# Altium schematic sheet power.SchDoc
size A; SheetNumber: 6; SheetTotal: 6
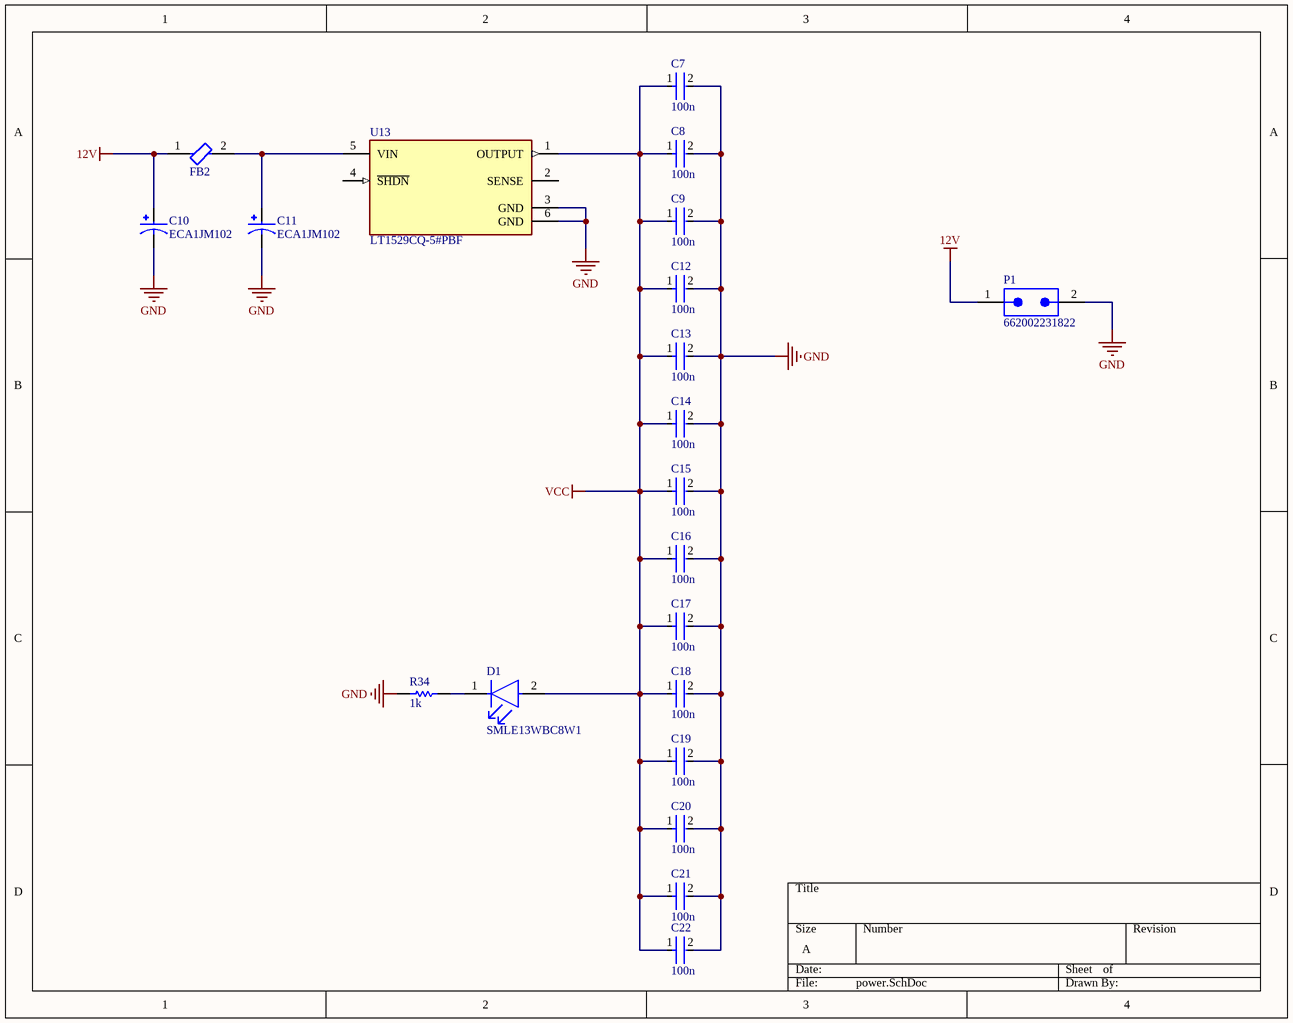
[diagram p0: power.SchDoc]

## Parts
C7  100n  [FP-CL10-IPC_C]
C8  100n  [FP-CL10-IPC_C]
C9  100n  [FP-CL10-IPC_C]
C10  ECA1JM102  [CAPPRD750W80D1600H2500]
C11  ECA1JM102  [CAPPRD750W80D1600H2500]
C12  100n  [FP-CL10-IPC_C]
C13  100n  [FP-CL10-IPC_C]
C14  100n  [FP-CL10-IPC_C]
C15  100n  [FP-CL10-IPC_C]
C16  100n  [FP-CL10-IPC_C]
C17  100n  [FP-CL10-IPC_C]
C18  100n  [FP-CL10-IPC_C]
C19  100n  [FP-CL10-IPC_C]
C20  100n  [FP-CL10-IPC_C]
C21  100n  [FP-CL10-IPC_C]
C22  100n  [FP-CL10-IPC_C]
D1  SMLE13WBC8W1  [FP-SMLE13WBC8W1-MFG]
FB2  BLM18KG121TN1D  [FP-BLM18-0_15-t0_6-d1_2-IPC_A]  (value not drawn)
P1  662002231822  [662002231822]
R34  1k  [RESC2013X60X35ML10T20]
U13  LT1529CQ-5#PBF  [FP-Q-5-05-08-1461-MFG]

## Nets
12V: C10.P FB2.1 P1.1
GND: C7.2 C8.2 C9.2 C10.N C11.N C12.2 C13.2 C14.2 C15.2 C16.2 C17.2 C18.2 C19.2 C20.2 C21.2 C22.2 P1.2 R34.1 U13.3(GND) U13.6(GND)
VCC: C7.1 C8.1 C9.1 C12.1 C13.1 C14.1 C15.1 C16.1 C17.1 C18.1 C19.1 C20.1 C21.1 C22.1 D1.2(A) U13.1(OUTPUT)
NetC11_P: C11.P FB2.2 U13.5(VIN)
NetD1_1: D1.1(C) R34.2

Not connected (* = marked no-connect by the designer): U13 2(SENSE) 4(~{SHDN})

## Library data of the parts
C7-C9 C12-C22 = CMP-13271-003017-1: Cap Ceramic 4.7uF 10V X5R ±10% Pad SMD 0603 +85°C T/R; Capacitance: 4.7uF; Case/Package: 0603; Packaging: Tape and Reel; Width: 0.031inch; Contact Plating: Tin; Thickness: 0.035inch; Package Quantity: 1; Voltage Rating: 10V; Case Code (Metric): 1608; Case Code (Imperial): 0603; Depth: 0.8mm; Height: 0.8mm; Tolerance: 10%; Max Operating Temperature: 85°C; Length: 1.6mm; Dielectric: X5R; Mount: Surface Mount; Radiation Hardening: No; Min Operating Temperature: -55°C
C10 C11 = ECA1JM102: 1000ÂµF 63V Aluminum Electrolytic Capacitors Radial, Can 2000 Hrs @ 85Â°C; MF: Panasonic; Availability: Not in stock; Check_prices: https://www.snapeda.com/parts/ECA1JM102/Panasonic/view-part/5782477/?ref=eda; Package: RADIAL-2 Panasonic; SnapEDA_Link: https://www.snapeda.com/parts/ECA1JM102/Panasonic/view-part/5782477/?ref=snap; MP: ECA1JM102; Price: None; Value: *
D1 = CMP-08952-000004-1: LED WHITE 0603 SMD; Manufacturer: Rohm; Luminous Intensity: 140mcd; Led Orientation: Top View; Reverse Voltage: 5V; Forward Voltage: 2.9V; Forward Current: 5mA; Power Dissipation: 66mW; Temperature Range Low: -40°C; Digikey Description: LED WHITE 0603 SMD; Temperature Range High: +85°C; Temperature: -40°C to +85°C; Manufacturer Part Number: SMLE13WBC8W1; Colour: White; Mouser Description: Standard LEDs - SMD ExceLED White LED 120mcd 5mA; Octopart: https://octopart.com/smle13wbc8w1-rohm-22224565; Automotive: No; Device Class L2: LEDs; Lead Free: Yes; ComponentLink2URL: https://media.digikey.com/pdf/Data%20Sheets/Rohm%20PDFs/SMLE13WBC8W1_Spec.pdf; Device Class L3: unset; Package: 0; RoHS: TRUE; Height: 0.4mm; Category: Diode; Device Class L1: Optoelectronics; ComponentLink2Description: Datasheet
FB2 = CMP-0686-00554-8: FERRITE BEAD 120 OHM 0603 1LN; Max Current Rating: 3A; DC Resistance (DCR): 30mR; Impedance: 120R; Number of Lines: 1; Test Frequency: 100MHz; Tolerance: 25%; Package Quantity: 4000; Min Operating Temperature: -55°C; Termination: SMD/SMT; REACH SVHC: No SVHC; Core Material: Ferrite; Material: Ferrite; Current Rating: 3A; Height: 0.8mm; Number of Pins: 2; Case/Package: 0603; Case Code (Imperial): 0603; Series: BLM18K; Packaging: Tape and Reel; Inductor Type: FERRITE BEAD; Lead Free: Lead Free; Width: 0.8mm; Case Code (Metric): 1608; Number of Circuits: 1; Max DC Current: 3A; Depth: 0.95mm; Max Operating Temperature: 125°C; Length: 1.6mm; RoHS Compliant: Yes
P1 = CMP-1502-00340-2: NexarPartId: 8917600; Contact Resistance: 10mΩ; Connector Type: Male Pin, Socket; Row Spacing: 2.9972mm; Number of Contacts: 2; Gender: Male; Operating Supply Voltage: 250V; Current Rating: 5A; Pitch: 3mm; Insulation Resistance: 1GΩ; Contact Material: Copper; Lead Pitch: 3mm; Mount: Surface Mount; Number of Pins: 2; Max Operating Temperature: 105°C; Contact Plating: Tin; RoHS: Compliant; Color: Black; Width: 6.7mm; Termination: Solder; Fastening Type: Ramp; Number of Rows: 2; Height: 9.9mm; Min Operating Temperature: -40°C; Length: 6.7mm; Orientation: Vertical; REACH SVHC: Unknown; Housing Material: Nylon; Number of Positions: 2
R34 = CMP-2100-03673-1: Chip Resistor, 0 Ohm, Jumper, +/- 5%, 0.125 W, -55 to 155 degC, 0805 (2012 Metric), RoHS, Tape and Reel; Manufacturer: Yageo; Power Rating: 125mW; Resistance: 0mOhm; Voltage Rating (DC): 150V; Temperature Coefficient: 200ppm/degreesC; Height: 0.5mm; Depth: 1.25mm; Case Code (Imperial): 0805; Lead Free: LeadFree; Military Standard: Not; Package Description: 2-Pin Surface Mounted Device, Body 2 x 1.25 mm; Case Code (Metric): 2012; Composition: ThickFilm; Voltage Rating: 150V; Manufacturer URL: http://www.yageo.com/; Packaging: TapeandReel; Package Reference: 0805; REACH SVHC: Unknown; Tolerance: 5%; Case/Package: 0805; Max Operating Temperature: 155degC; Number of Pins: 2; Min Operating Temperature: -55degC; RoHSCompliant: true; Length: 2mm; Datasheet URL: http://www.yageo.com/NewPortal/yageodocoutput?fileName=/pdf/R-Chip/PYu-RC_Group_51_RoHS_L_5.pdf; Termination: SMD/SMT; Radiation Hardening: No; Width: 1.25mm; Contact Plating: Tin; Datasheet Version: Rev. 5, 10/2016
U13 = CMP-0476-01142-2: NexarPartId: 533167; Output Voltage: 5V; Nominal Supply Current: 50µA; Number of Channels: 1; Min Current Limit: 3.2A; Max Input Voltage: 15V; Output Current: 3A; Min Input Voltage: 3.8V; Dropout Voltage: 600mV; Max Junction Temperature (Tj): 125°C; Power Supply Rejection Ratio (PSRR): 62dB; Polarity: Positive; Output Type: Fixed; Nominal Output Voltage: 5V; Width: 9.4mm; Length: 10.54mm; Schedule B: 8542390000, 8542390000; Radiation Hardening: No; Packaging: Bulk; Max Supply Voltage: 15V; Operating Supply Current: 50µA; RoHS: Compliant; Max Output Current: 3A; Max Operating Temperature: 125°C; Min Operating Temperature: 0°C; Number of Pins: 5; Quiescent Current: 50µA; Lead Free: Lead Free; Case/Package: Q; Number of Regulators: 1; REACH SVHC: No SVHC; Height: 4.57mm; Lifecycle Status: Production; Number of Outputs: 1